# Altium schematic sheet BLDC_Motor.SchDoc
size OrCAD B; SheetNumber: 1; SheetTotal: 1
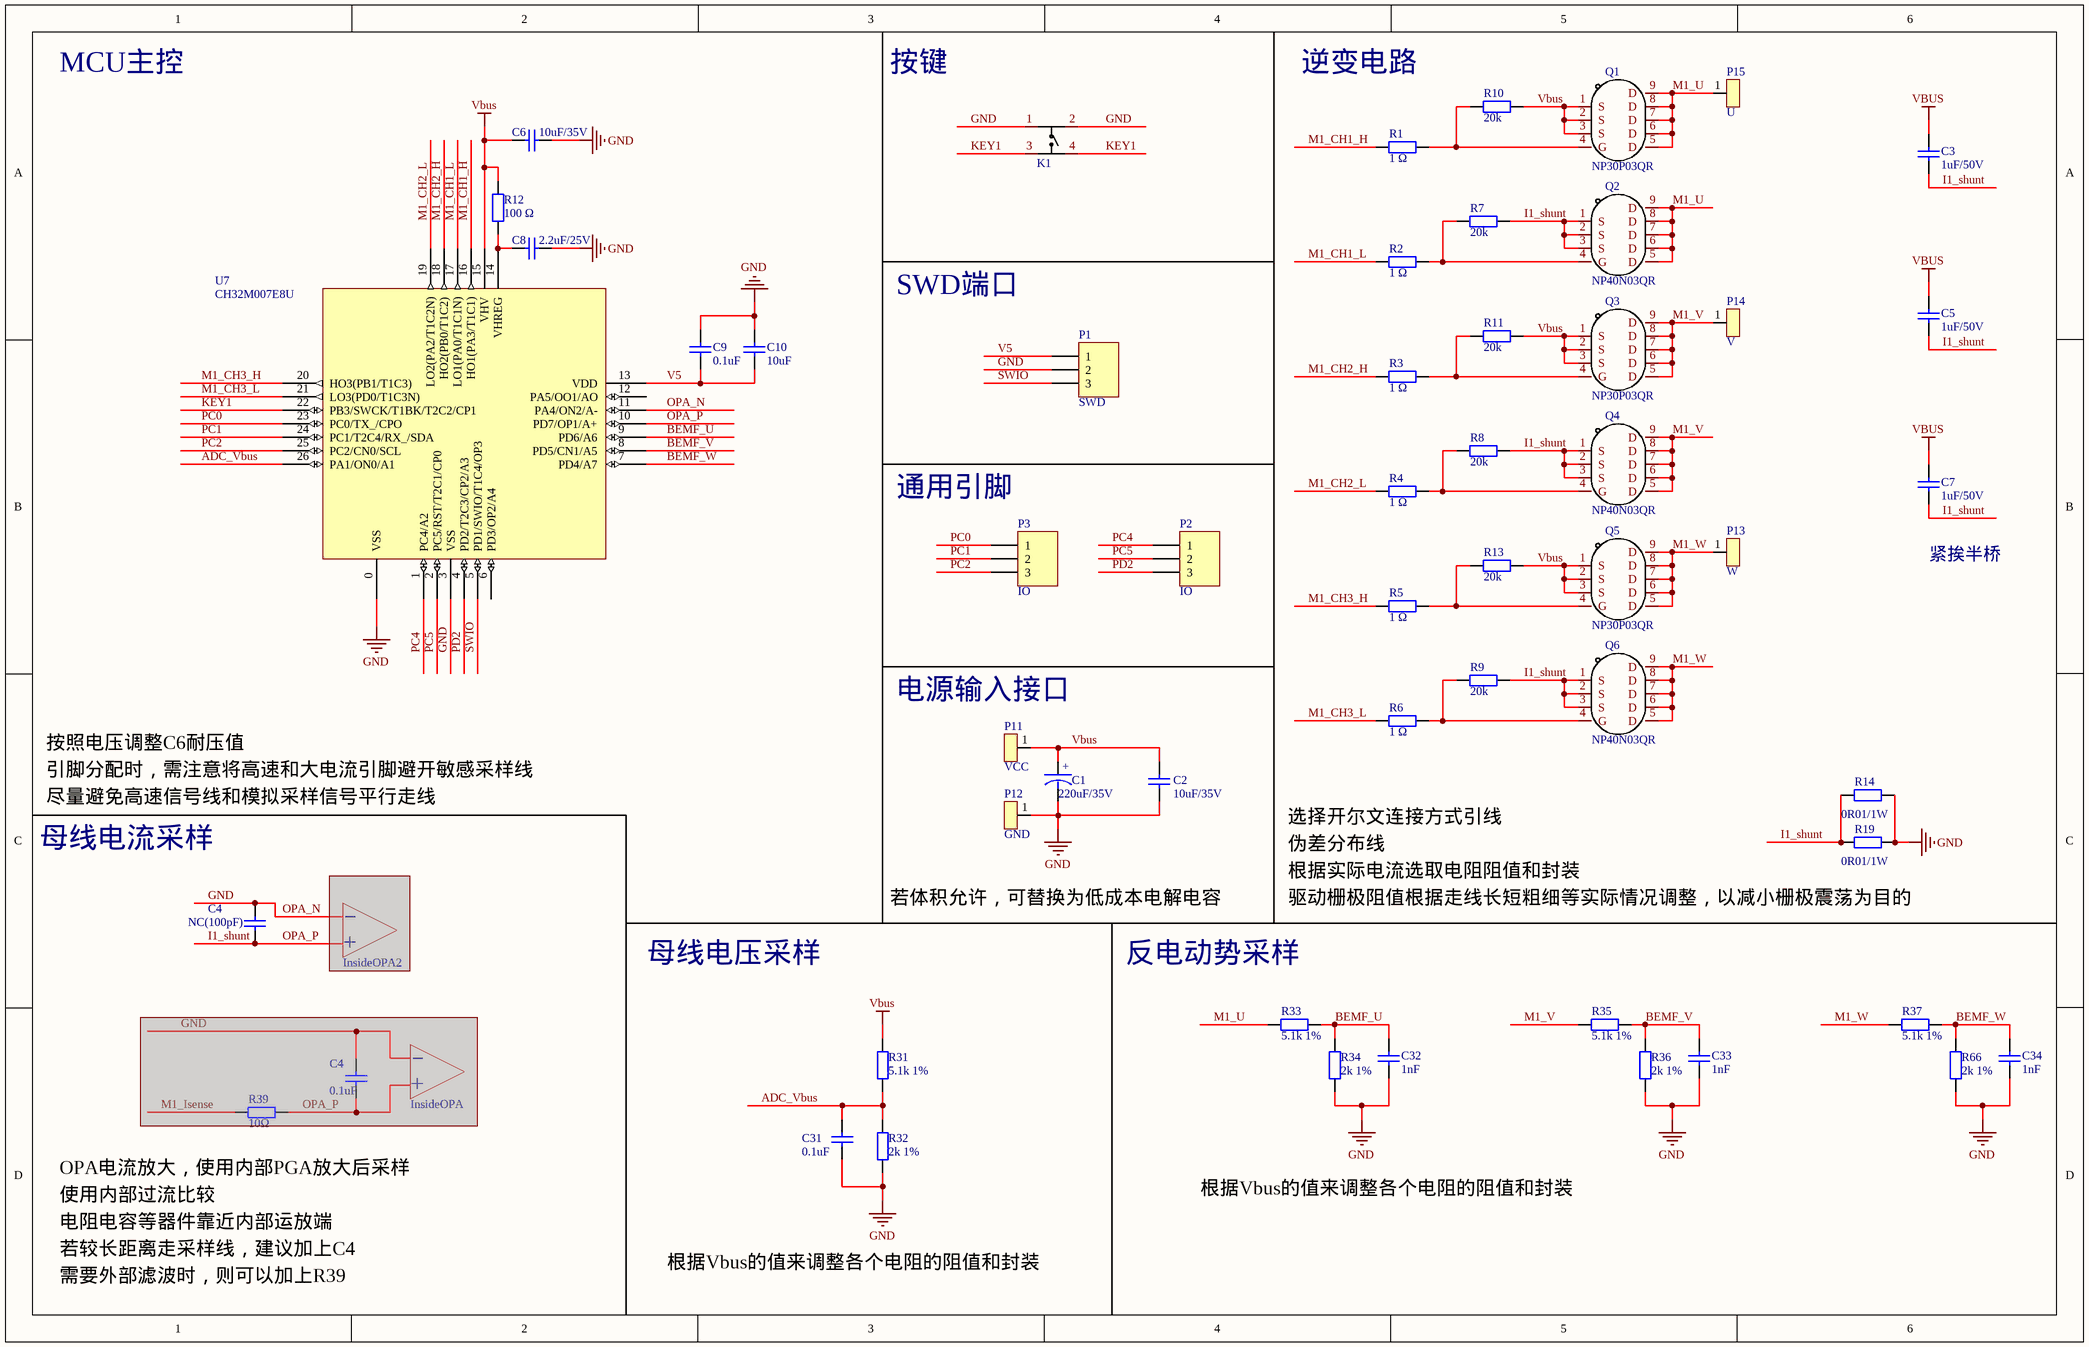
[diagram p0: BLDC_Motor.SchDoc]

## Parts
(Parts that share a designator on the sheet are numbered #1, #2 ... from top to bottom, then left to right.)
C1  220uF/35V  [CAP-TH_BD8.0-P3.5-D0.6-FD]
C2  10uF/35V  [M_C0805-]
C3  1uF/50V  [M_C0805-]
C4#1  NC(100pF)  [M_C0402-]
C4#2  0.1uF  [M_C0402-]  (masked out: inside a compile mask, not in the netlist)
C5  1uF/50V  [M_C0805-]
C6  10uF/35V  [M_C0805-]
C7  1uF/50V  [M_C0805-]
C8  2.2uF/25V  [M_C0603]
C9  0.1uF  [M_C0402-]
C10  10uF  [M_C0603]
C31  0.1uF  [M_C0402-]
C32  1nF  [M_C0402-]
C33  1nF  [M_C0402-]
C34  1nF  [M_C0402-]
K1  KH-6X6X8H-STM  [KEY2-SMD]  (value not drawn)
P1  SWD  [HDR2.54-LI-3P]
P2  IO  [HDR2.54-LI-3P]
P3  IO  [HDR2.54-LI-3P]
P11  VCC  [M_PAD-1.2/2]
P12  GND  [M_PAD-1.2/2]
P13  W  [M_PAD-1.2/2]
P14  V  [M_PAD-1.2/2]
P15  U  [M_PAD-1.2/2]
Q1  NP30P03QR  [M_PDFN-8_L3.2-W3.0]
Q2  NP40N03QR  [M_PDFN-8_L3.2-W3.0]
Q3  NP30P03QR  [M_PDFN-8_L3.2-W3.0]
Q4  NP40N03QR  [M_PDFN-8_L3.2-W3.0]
Q5  NP30P03QR  [M_PDFN-8_L3.2-W3.0]
Q6  NP40N03QR  [M_PDFN-8_L3.2-W3.0]
R1  1 Ω  [M_R0603]
R2  1 Ω  [M_R0603]
R3  1 Ω  [M_R0603]
R4  1 Ω  [M_R0603]
R5  1 Ω  [M_R0603]
R6  1 Ω  [M_R0603]
R7  20k  [M_R0402-]
R8  20k  [M_R0402-]
R9  20k  [M_R0402-]
R10  20k  [M_R0402-]
R11  20k  [M_R0402-]
R12  100 Ω  [M_R0805-]
R13  20k  [M_R0402-]
R14  0R01/1W  [M_R1206-]
R19  0R01/1W  [M_R1206-]
R31  5.1k 1%  [M_R0603]
R32  2k 1%  [M_R0402-]
R33  5.1k 1%  [M_R0603]
R34  2k 1%  [M_R0402-]
R35  5.1k 1%  [M_R0603]
R36  2k 1%  [M_R0402-]
R37  5.1k 1%  [M_R0603]
R39  10Ω  [M_R0402-]  (masked out: inside a compile mask, not in the netlist)
R66  2k 1%  [M_R0402-]
U7  CH32M007E8U  [QFN26C_3X3]
U?#1  InsideOPA2  (masked out: inside a compile mask, not in the netlist)
U?#2  InsideOPA  (masked out: inside a compile mask, not in the netlist)

## Nets
GND: C1.2 C2.2 C4#1.1 C6.2 C8.2 C9.2 C10.2 C31.2 C32.2 C33.2 C34.2 K1.1(A) K1.2(B) P1.2 P12.1 R14.1 R19.1 R32.1 R34.2 R36.2 R66.2 U7.0(VSS) U7.3(VSS) U7.11(PA4/ON2/A-)  [also labelled OPA_N]
Vbus: C1.1 C2.1 C3.1 C5.1 C6.1 C7.1 P11.1 Q1.1(S) Q1.2(S) Q1.3(S) Q3.1(S) Q3.2(S) Q3.3(S) Q5.1(S) Q5.2(S) Q5.3(S) R10.1 R11.1 R12.2 R13.1 R31.2 U7.15(VHV)
ADC_Vbus: C31.1 R31.1 R32.2 U7.26(PA1/ON0/A1)
BEMF_U: C32.1 R33.1 R34.1 U7.9(PD6/A6)
BEMF_V: C33.1 R35.1 R36.1 U7.8(PD5/CN1/A5)
BEMF_W: C34.1 R37.1 R66.1 U7.7(PD4/A7)
I1_shunt: C3.2 C4#1.2 C5.2 C7.2 Q2.1(S) Q2.2(S) Q2.3(S) Q4.1(S) Q4.2(S) Q4.3(S) Q6.1(S) Q6.2(S) Q6.3(S) R7.1 R8.1 R9.1 R14.2 R19.2 U7.10(PD7/OP1/A+)  [also labelled OPA_P]
KEY1: K1.3(C) K1.4(D) U7.22(PB3/SWCK/T1BK/T2C2/CP1)
M1_CH1_H: R1.2 U7.16(HO1(PA3/T1C1))
M1_CH1_L: R2.2 U7.17(LO1(PA0/T1C1N))
M1_CH2_H: R3.2 U7.18(HO2(PB0/T1C2))
M1_CH2_L: R4.2 U7.19(LO2(PA2/T1C2N))
M1_CH3_H: R5.2 U7.20(HO3(PB1/T1C3))
M1_CH3_L: R6.2 U7.21(LO3(PD0/T1C3N))
M1_U: P15.1 Q1.5(D) Q1.6(D) Q1.7(D) Q1.8(D) Q1.9(D) Q2.5(D) Q2.6(D) Q2.7(D) Q2.8(D) Q2.9(D) R33.2
M1_V: P14.1 Q3.5(D) Q3.6(D) Q3.7(D) Q3.8(D) Q3.9(D) Q4.5(D) Q4.6(D) Q4.7(D) Q4.8(D) Q4.9(D) R35.2
M1_W: P13.1 Q5.5(D) Q5.6(D) Q5.7(D) Q5.8(D) Q5.9(D) Q6.5(D) Q6.6(D) Q6.7(D) Q6.8(D) Q6.9(D) R37.2
PC0: P3.1 U7.23(PC0/TX_/CPO)
PC1: P3.2 U7.24(PC1/T2C4/RX_/SDA)
PC2: P3.3 U7.25(PC2/CN0/SCL)
PC4: P2.1 U7.1(PC4/A2)
PC5: P2.2 U7.2(PC5/RST/T2C1/CP0)
PD2: P2.3 U7.4(PD2/T2C3/CP2/A3)
SWIO: P1.3 U7.5(PD1/SWIO/T1C4/OP3)
V5: C9.1 C10.1 P1.1 U7.13(VDD)
NetC8_1: C8.1 R12.1 U7.14(VHREG)
NetQ1_4: Q1.4(G) R1.1 R10.2
NetQ2_4: Q2.4(G) R2.1 R7.2
NetQ3_4: Q3.4(G) R3.1 R11.2
NetQ4_4: Q4.4(G) R4.1 R8.2
NetQ5_4: Q5.4(G) R5.1 R13.2
NetQ6_4: Q6.4(G) R6.1 R9.2

Not connected (* = marked no-connect by the designer): U7 6(PD3/OP2/A4) 12(PA5/OO1/AO)

## Notes on the sheet
- MCU主控
- 按键
- 逆变电路
- SWD端口
- 通用引脚
- 紧挨半桥
- 按照电压调整C6耐压值
- (near P11) 电源输入接口
- 引脚分配时，需注意将高速和大电流引脚避开敏感采样线
- 尽量避免高速信号线和模拟采样信号平行走线
- 选择开尔文连接方式引线
- 母线电流采样
- 伪差分布线
- 根据实际电流选取电阻阻值和封装
- 母线电压采样
- 若体积允许，可替换为低成本电解电容
- 反电动势采样
- 驱动栅极阻值根据走线长短粗细等实际情况调整，以减小栅极震荡为目的
- (near R39) OPA电流放大，使用内部PGA放大后采样
- 使用内部过流比较
- 电阻电容等器件靠近内部运放端
- 根据Vbus的值来调整各个电阻的阻值和封装
- 若较长距离走采样线，建议加上C4
- 需要外部滤波时，则可以加上R39
- (in symbol CAPACITOR POL_2) +
- (in symbol InsideOPA) +

## Library data of the parts
C1 = CAPACITOR POL_2: Capacitor; Value: 220uF/35V
C2 C3 C4#1 C4#2 C5-C10 C31-C34 = Cap Semi: Capacitor (Semiconductor SIM Model); Published: 8-Jun-2000; LatestRevisionDate: 17-Jul-2002; LatestRevisionNote: Re-released for DXP Platform.; PackageReference: C0805; Publisher: Altium Limited
  C2 C6: Value: 10uF/35V
  C3 C5 C7: Value: 1uF/50V
  C4#1: Value: NC(100pF)
  C4#2 C9 C31: Value: 0.1uF
  C8: Value: 2.2uF/25V
  C10: Value: 10uF
  C32-C34: Value: 1nF
K1 = KH-6X6X8H-STM: Add into BOM: yes; Contact Current: 50mA; Voltage Rating (DC): 12V; Mechanical Life: 80000; Switch Length: 6mm; Name: KH-6X6X8H-STM; Symbol: KH-6X6X8H-STM; Device: KH-6X6X8H-STM; LCSC Part Name: KH-6X6X8H-STM; Supplier Part: C2837534; Manufacturer Part: KH-6X6X8H-STM; Supplier Footprint: SMD; JLCPCB Part Class: Extended Part; Datasheet: https://atta.szlcsc.com/upload/public/pdf/source/20210608/C2837534_94EAC7D8AFBB996E2814FACF50FEEF85.pdf; Supplier: LCSC; Convert to PCB: yes; Voltage Rating (AC): -; Power Rating: -; With Lamp: -; Operating Force: -; Operating Temperature: -; IP Rating: -; Switch Width: 6mm; Switch Height: -
P1-P3 = HEADER 3: Header, 3-Pin
P11-P15 = 1PIN: CONNECTOR
Q1-Q6 = NP45N03QR: Add into BOM: yes; Drain Source Voltage (Vdss): 30V; Continuous Drain Current (Id): 45A; Power Dissipation (Pd): 28W; Gate Threshold Voltage (Vgs(th)@Id): 1.6V@250uA; Total Gate Charge (Qg@Vgs): 12.6nC@4.5V; Input Capacitance (Ciss@Vds): 1.317nF@20V; Reverse Transfer Capacitance (Crss@Vds): 131pF@20V; Name: NP45N03QR; Symbol: NP45N03QR; Device: NP45N03QR; Supplier Part: C2991149; Manufacturer Part: NP45N03QR; Supplier Footprint: PDFN-8(3x3.2); JLCPCB Part Class: Extended Part; Datasheet: https://atta.szlcsc.com/upload/public/pdf/source/20220426/A2B1C2F00A7559BD8C21E562299187AE.pdf; Supplier: LCSC; Convert to PCB: yes
R1-R14 R19 R31-R37 R39 R66 = Res2: Resistor; Published: 8-Jun-2000; LatestRevisionDate: 17-Jul-2002; LatestRevisionNote: Re-released for DXP Platform.; PackageReference: AXIAL-0.4; Publisher: Altium Limited
  R1-R6: Value: 1 Ω
  R7-R11 R13: Value: 20k
  R12: Value: 100 Ω
  R14 R19: Value: 0R01/1W
  R31 R33 R35 R37: Value: 5.1k 1%
  R32 R34 R36 R66: Value: 2k 1%
  R39: Value: 10Ω
U7 = CH32M007E8U6: RISC-V MCU, 48MHz, OPA/CMP/UART/I2C, 24V P/NMOS gate driver for motor
U?#1 = InsideOPA